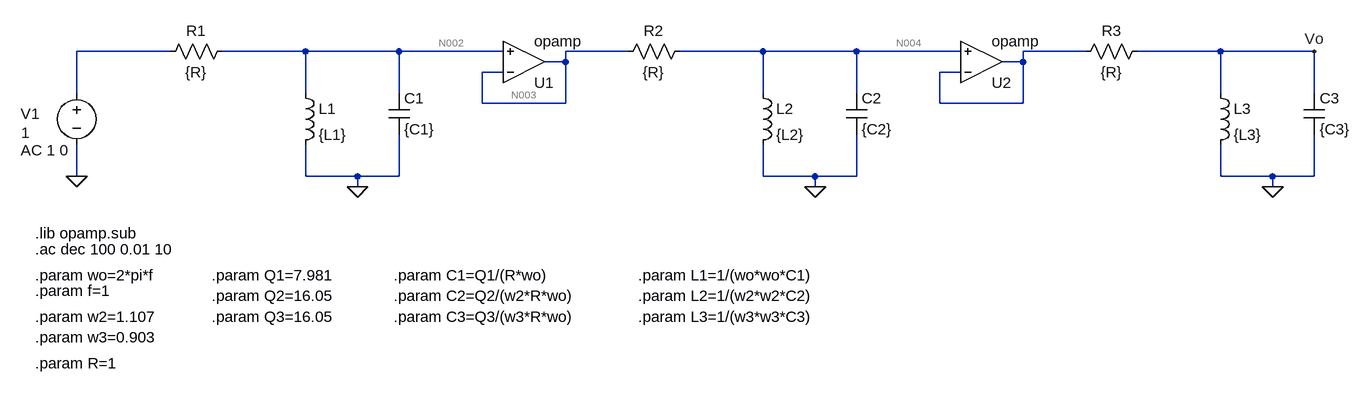
[diagram p0: schematic TS4BisBis.asc]
TS4BisBis.asc, the LTspice schematic file:
Version 4
SHEET 1 1972 680
WIRE 144 80 0 80
WIRE 352 80 224 80
WIRE 496 80 352 80
WIRE 656 80 496 80
WIRE 848 80 752 80
WIRE 1056 80 928 80
WIRE 1200 80 1056 80
WIRE 1360 80 1200 80
WIRE 1552 80 1456 80
WIRE 1760 80 1632 80
WIRE 1904 80 1760 80
WIRE 752 96 752 80
WIRE 752 96 720 96
WIRE 1456 96 1456 80
WIRE 1456 96 1424 96
WIRE 656 112 624 112
WIRE 1360 112 1328 112
WIRE 0 144 0 80
WIRE 352 144 352 80
WIRE 496 144 496 80
WIRE 1056 144 1056 80
WIRE 1200 144 1200 80
WIRE 1760 144 1760 80
WIRE 1904 144 1904 80
WIRE 624 160 624 112
WIRE 752 160 752 96
WIRE 752 160 624 160
WIRE 1328 160 1328 112
WIRE 1456 160 1456 96
WIRE 1456 160 1328 160
WIRE 0 272 0 224
WIRE 352 272 352 224
WIRE 432 272 352 272
WIRE 496 272 496 208
WIRE 496 272 432 272
WIRE 1056 272 1056 224
WIRE 1136 272 1056 272
WIRE 1200 272 1200 208
WIRE 1200 272 1136 272
WIRE 1760 272 1760 224
WIRE 1840 272 1760 272
WIRE 1904 272 1904 208
WIRE 1904 272 1840 272
WIRE 432 288 432 272
WIRE 1136 288 1136 272
WIRE 1840 288 1840 272
FLAG 0 272 0
FLAG 432 288 0
FLAG 1136 288 0
FLAG 1840 288 0
FLAG 1904 80 Vo
SYMBOL voltage 0 128 R0
WINDOW 0 -86 48 Left 2
WINDOW 3 -85 77 Left 2
WINDOW 123 -86 104 Left 2
WINDOW 39 0 0 Left 0
SYMATTR InstName V1
SYMATTR Value 1
SYMATTR Value2 AC 1 0
SYMBOL res 240 64 R90
WINDOW 0 0 56 VBottom 2
WINDOW 3 32 56 VTop 2
SYMATTR InstName R1
SYMATTR Value {R}
SYMBOL ind 336 128 R0
SYMATTR InstName L1
SYMATTR Value {L1}
SYMBOL cap 480 144 R0
SYMATTR InstName C1
SYMATTR Value {C1}
SYMBOL OpAmps\\opamp 688 160 M180
SYMATTR InstName U1
SYMBOL res 944 64 R90
WINDOW 0 0 56 VBottom 2
WINDOW 3 32 56 VTop 2
SYMATTR InstName R2
SYMATTR Value {R}
SYMBOL ind 1040 128 R0
SYMATTR InstName L2
SYMATTR Value {L2}
SYMBOL cap 1184 144 R0
SYMATTR InstName C2
SYMATTR Value {C2}
SYMBOL OpAmps\\opamp 1392 160 M180
SYMATTR InstName U2
SYMBOL res 1648 64 R90
WINDOW 0 0 56 VBottom 2
WINDOW 3 32 56 VTop 2
SYMATTR InstName R3
SYMATTR Value {R}
SYMBOL ind 1744 128 R0
SYMATTR InstName L3
SYMATTR Value {L3}
SYMBOL cap 1888 144 R0
SYMATTR InstName C3
SYMATTR Value {C3}
TEXT -64 360 Left 2 !.lib opamp.sub
TEXT -64 424 Left 2 !.param wo=2*pi*f
TEXT -64 448 Left 2 !.param f=1
TEXT -64 488 Left 2 !.param w2=1.107
TEXT -64 520 Left 2 !.param w3=0.903
TEXT -64 560 Left 2 !.param R=1
TEXT 208 424 Left 2 !.param Q1=7.981
TEXT 208 456 Left 2 !.param Q2=16.05
TEXT 208 488 Left 2 !.param Q3=16.05
TEXT 488 424 Left 2 !.param C1=Q1/(R*wo)
TEXT 488 456 Left 2 !.param C2=Q2/(w2*R*wo)
TEXT 488 488 Left 2 !.param C3=Q3/(w3*R*wo)
TEXT 864 424 Left 2 !.param L1=1/(wo*wo*C1)
TEXT 864 456 Left 2 !.param L2=1/(w2*w2*C2)
TEXT 864 488 Left 2 !.param L3=1/(w3*w3*C3)
TEXT -64 384 Left 2 !.ac dec 100 0.01 10

The netlist it stands for:
* TS4BisBis.asc
V1 N001 0 1 AC 1 0
R1 N002 N001 {R}
L1 N002 0 {L1}
C1 N002 0 {C1}
XU1 N003 N002 N003 opamp Aol=100K GBW=10Meg  ; pins invin noninvin out
R2 N004 N003 {R}
L2 N004 0 {L2}
C2 N004 0 {C2}
XU2 N005 N004 N005 opamp Aol=100K GBW=10Meg  ; pins invin noninvin out
R3 Vo N005 {R}
L3 Vo 0 {L3}
C3 Vo 0 {C3}
.lib opamp.sub
.param wo=2*pi*f
.param f=1
.param w2=1.107
.param w3=0.903
.param R=1
.param Q1=7.981
.param Q2=16.05
.param Q3=16.05
.param C1=Q1/(R*wo)
.param C2=Q2/(w2*R*wo)
.param C3=Q3/(w3*R*wo)
.param L1=1/(wo*wo*C1)
.param L2=1/(w2*w2*C2)
.param L3=1/(w3*w3*C3)
.ac dec 100 0.01 10
.backanno
.end

* Results of the author's LTspice run, read from the files saved beside the schematic
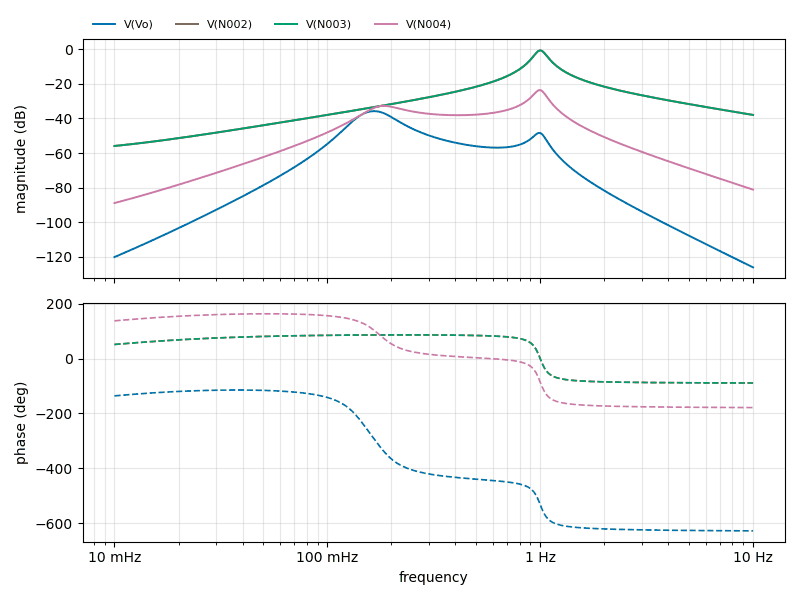
[diagram p1: AC Analysis of TS4BisBis.asc, plotted from the saved traces]
* AC Analysis, 1 run:
*   V(Vo): -120.21 dB at 10 mHz, -126.17 dB at 10 Hz, peak -35.76 dB at 166 mHz, 3 dB below the peak at 140.6 mHz and 197.1 mHz
*   V(N002): -55.91 dB at 10 mHz, -37.95 dB at 10 Hz, peak -0.54 dB at 1 Hz, 3 dB below the peak at 936.1 mHz and 1.069 Hz
*   V(N003): -55.91 dB at 10 mHz, -37.95 dB at 10 Hz, peak -0.54 dB at 1 Hz, 3 dB below the peak at 936.1 mHz and 1.069 Hz
*   V(N004): -88.95 dB at 10 mHz, -81.18 dB at 10 Hz, peak -23.51 dB at 1 Hz, 3 dB below the peak at 925.8 mHz and 1.06 Hz